# Altium schematic sheet Peripheral.SchDoc
size A4; SheetNumber: 4; SheetTotal: 5; FILE: PERIPHERAL
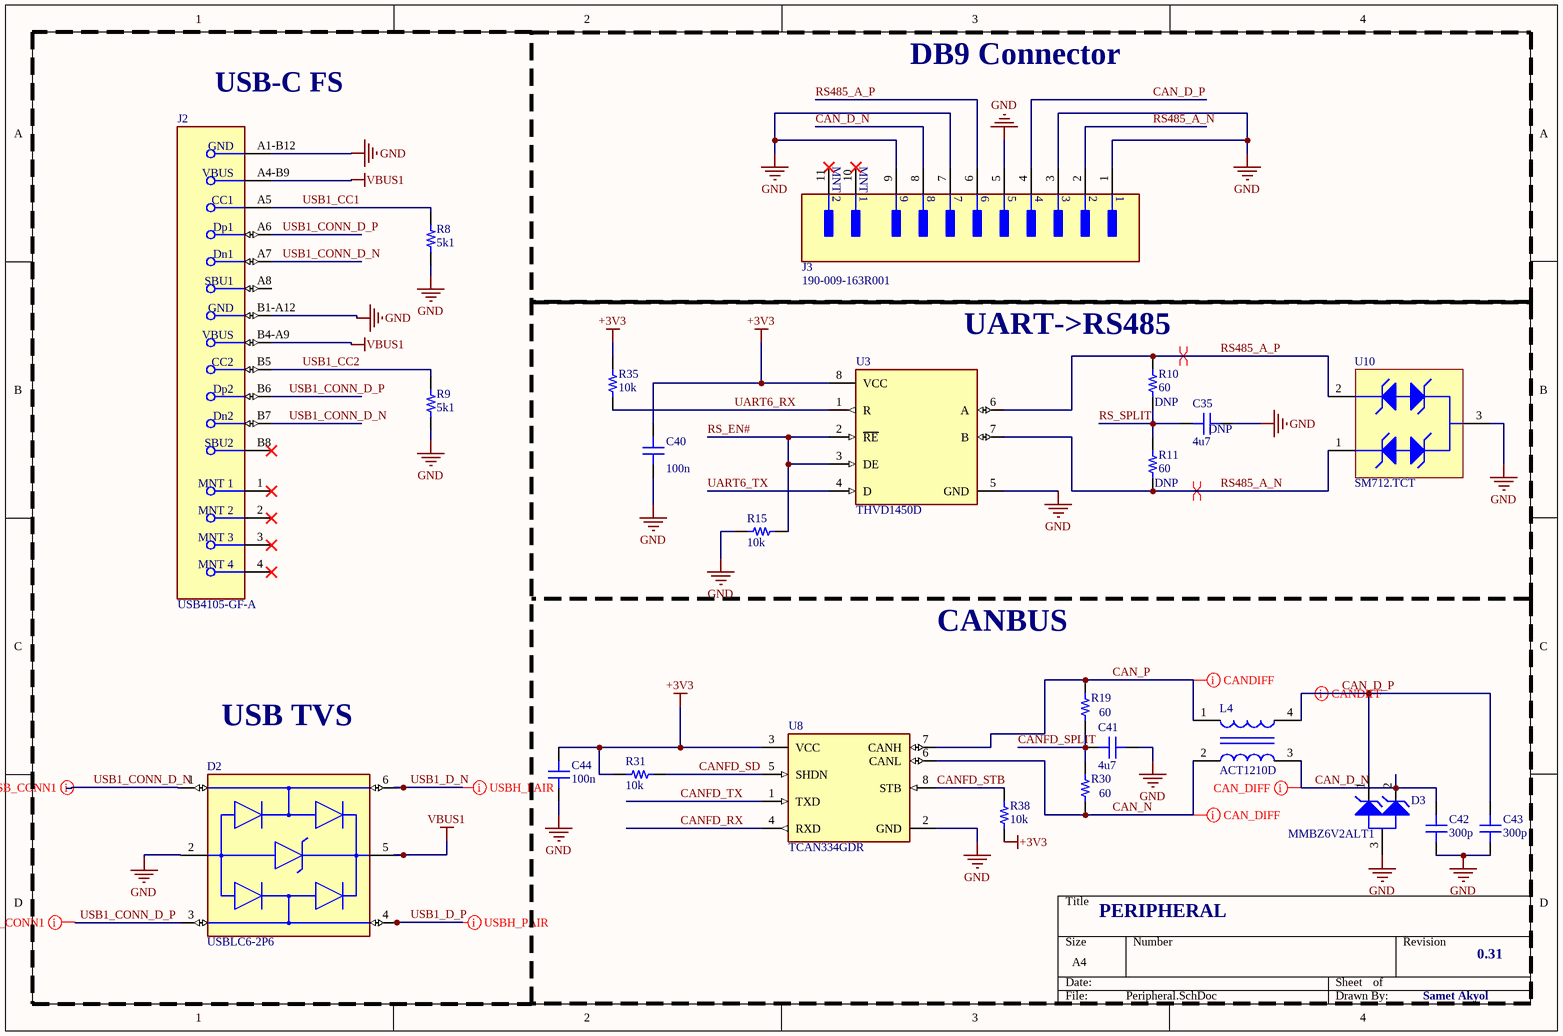
[diagram p0: Peripheral.SchDoc]

## Parts
C35  DNP  value 4u7  [CAP 0402_1005]
C40  value 100n  [CAP 0402_1005]  (hidden comment: DNP)
C41  4u7  [CAP 0402_1005]
C42  300p  [CAP 0402_1005]
C43  300p  [CAP 0402_1005]
C44  100n  [CAP 0402_1005]
D2  USBLC6-2P6  [FP-SOT-666-MFG]
D3  MMBZ6V2ALT1  [ONSC-SOT-23-3-318-08_V]
J2  USB4105-GF-A  [FP-USB4105-GF-A-MFG]
J3  190-009-163R001  [FP-190-009-163R001-MFG]
L4  ACT1210D  [FP-ACT1210D-MFG]
R8  5k1  [RES 0402_1005]
R9  5k1  [RES 0402_1005]
R10  DNP  value 60  [RES 0402_1005]
R11  DNP  value 60  [RES 0402_1005]
R15  10k  [RES 0402_1005]
R19  60  [RES 0402_1005]
R30  60  [RES 0402_1005]
R31  10k  [RES 0402_1005]
R35  value 10k  [RES 0402_1005]
R38  10k  [RES 0402_1005]
U3  THVD1450D  [FP-D0008A-IPC_B]
U8  TCAN334GDR  [FP-D0008A-IPC_B]
U10  SM712.TCT  [SMTC-SOT23-3_V]

## Blocks framed on the sheet
USB TVS: D2 J2 R8 R9

## Nets
+3V3: C40.1 C44.1 R31.2 R35.2 R38.2 U3.8(VCC) U8.3(VCC)
GND: C35.2 C40.2 C41.1 C42.1 C43.1 C44.2 D2.2(GND) D3.3(A) J2.A1-B12(GND) J2.B1-A12(GND) J3.1 J3.3 J3.5 J3.7 J3.9 R8.1 R9.1 R15.2 U3.5(GND) U8.2(GND) U10.3
VBUS1: D2.5(VBUS) J2.A4-B9(VBUS) J2.B4-A9(VBUS)
CAN_D_N: C42.2 D3.2(K2) J3.8 L4.3
CAN_D_P: C43.2 D3.1(K1) J3.4 L4.4
CAN_N: L4.2 R30.1 U8.6(CANL)
CAN_P: L4.1 R19.2 U8.7(CANH)
CANFD_RX: U8.4(RXD)
CANFD_SD: R31.1 U8.5(SHDN)
CANFD_SPLIT: C41.2 R19.1 R30.2
CANFD_STB: R38.1 U8.8(STB)
CANFD_TX: U8.1(TXD)
RS485_A_N: J3.2 R11.1 U3.7(B) U10.1
RS485_A_P: J3.6 R10.2 U3.6(A) U10.2
RS_EN#: R15.1 U3.2(~{RE}) U3.3(DE)
RS_SPLIT: C35.1 R10.1 R11.2
UART6_RX: R35.1 U3.1(R)
UART6_TX: U3.4(D)
USB1_CC1: J2.A5(CC1) R8.2
USB1_CC2: J2.B5(CC2) R9.2
USB1_CONN_D_N: D2.1(I/O1) J2.A7(Dn1) J2.B7(Dn2)
USB1_CONN_D_P: D2.3(I/O2) J2.A6(Dp1) J2.B6(Dp2)
USB1_D_N: D2.6(I/O1)
USB1_D_P: D2.4(I/O2)

Not connected (* = marked no-connect by the designer): J2 1(MNT_1)* 2(MNT_2)* 3(MNT_3)* 4(MNT_4)* A8(SBU1) B8(SBU2)*; J3 10(MNT_1)* 11(MNT_2)*

## Layout directives
differential pair: CAN_D_N, CAN_D_P, CAN_N, CAN_P, RS485_A_N, RS485_A_P, USB1_CONN_D_N, USB1_CONN_D_P, USB1_D_N, USB1_D_P

## Notes on the sheet
- USB-C FS
- DB9 Connector
- UART->RS485
- CANBUS
- PERIPHERAL
- 0.31
- Samet Akyol

## Library data of the parts
C35 = C1005X6S0G475M050BC: CAP CER 4.7UF 4V X6S 0402; manufacturer: TDK Corporation; Capacitance: 4.7 µF; Tolerance: ±20%; Part Number: C1005X6S0G475M050BC; Applications: General Purpose; componentlink1description: Datasheet; componentlink1url: https://product.tdk.com/info/en/catalog/datasheets/mlcc_commercial_general_en.pdf?ref_disty=digikey; componentlink2description: DigiKey Link; componentlink2url: https://www.digikey.com/en/products/detail/tdk-corporation/C1005X6S0G475M050BC/2792242; Device Package: 0402 (1005 Metric); Features: Low ESL; lastupdated: 9.02.2024 20:04:38; Lifecycle Status: Active; Minimum Order: 1; Mounting Type: Surface Mount, MLCC; Operating Temperature: -55°C ~ 105°C; Package / Case: 0402 (1005 Metric); packaging: TapeAndReel; partid: 1756; Part Status: Active; price: 0.06; series: C; Size / Dimension: 0.039" L x 0.020" W (1.00mm x 0.50mm); Supplier 1: DigiKey; Supplier Part Number 1: 445-8017-1-ND; Temperature Coefficient: X6S; Thickness (Max): 0.026" (0.65mm); Voltage - Rated: 4V
C40 = C1005X6S0G475M050BC: CAP CER 0.1UF 4V X6S 0402; manufacturer: TDK Corporation; Capacitance: 4.7 µF; Tolerance: ±20%; Part Number: C1005X6S0G475M050BC; Applications: General Purpose; componentlink1description: Datasheet; componentlink1url: https://product.tdk.com/info/en/catalog/datasheets/mlcc_commercial_general_en.pdf?ref_disty=digikey; componentlink2description: DigiKey Link; componentlink2url: https://www.digikey.com/en/products/detail/tdk-corporation/C1005X6S0G475M050BC/2792242; Device Package: 0402 (1005 Metric); Features: Low ESL; lastupdated: 9.02.2024 20:04:38; Lifecycle Status: Active; Minimum Order: 1; Mounting Type: Surface Mount, MLCC; Operating Temperature: -55°C ~ 105°C; Package / Case: 0402 (1005 Metric); packaging: TapeAndReel; partid: 1756; Part Status: Active; price: 0.06; series: C; Size / Dimension: 0.039" L x 0.020" W (1.00mm x 0.50mm); Supplier 1: DigiKey; Supplier Part Number 1: 445-8017-1-ND; Temperature Coefficient: X6S; Thickness (Max): 0.026" (0.65mm); Voltage - Rated: 4V
C41-C44 = CL05B104KP5VPNC: CAP CER 100NF 10V X7R 0402; manufacturer: Samsung Electro-Mechanics; Capacitance: 0.1 µF; Tolerance: ±10%; Part Number: CL05B104KP5VPNC; Applications: Automotive; componentlink1description: Datasheet; componentlink1url: https://mm.digikey.com/Volume0/opasdata/d220001/medias/docus/5458/CL05B104KP5VPNC_Spec.pdf; componentlink2description: DigiKey Link; componentlink2url: https://www.digikey.com/en/products/detail/samsung-electro-mechanics/CL05B104KP5VPNC/20498482; Device Package: 0402 (1005 Metric); lastupdated: 9.02.2024 20:03:17; Lifecycle Status: Active; Minimum Order: 1; Mounting Type: Surface Mount, MLCC; Operating Temperature: -55°C ~ 125°C; Package / Case: 0402 (1005 Metric); packaging: TapeAndReel; partid: 56690; price: 0.01; Ratings: AEC-Q200; series: CL; Size / Dimension: 0.039" L x 0.020" W (1.00mm x 0.50mm); Supplier 1: DigiKey; Supplier Part Number 1: 1276-CL05B104KP5VPNCCT-ND; Temperature Coefficient: X7R; Thickness (Max): 0.022" (0.55mm); Voltage - Rated: 10V
  C41: Value: 4u7
  C42 C43: Value: 300p
  C44: Value: 100n
D2 = CMP-12225-000058-1: TVS DIODE 5.25V 17V SOT666; Min Breakdown Voltage: 6V; Power Line Protection: Yes; Element Configuration: Dual; Test Current: 1mA; Working Voltage: 5V; Number of Channels: 2; Max Reverse Leakage Current: 150nA; Direction: Unidirectional; Peak Pulse Current: 5A; Number of Elements: 1; Capacitance: 3.5pF; Max Breakdown Voltage: 6V; Height: 0.6mm; Depth: 1.3mm; Contact Plating: Tin; Reverse Breakdown Voltage: 6V; REACH SVHC: No SVHC; Operating Supply Voltage: 5V; Width: 1.3mm; Max Operating Temperature: 125°C; Reverse Standoff Voltage: 5V; ESD Protection: Yes; Package Quantity: 1; Termination: SMD/SMT; Length: 1.7mm; Leakage Current: 150nA; Number of Bidirectional Channels: 2; Case/Package: SOT-666; Min Operating Temperature: -40°C; Number of Pins: 6; Clamping Voltage: 17V; Breakdown Voltage: 6V; Lead Free: Lead Free; Radiation Hardening: No; Packaging: Tape and Reel; Mount: Surface Mount; Polarity: Unidirectional
D3 = CMP-1060-01252-1: 24 W Peak Power Zener Transient Voltage Suppressor, Dual Common Anode Zeners for ESD Protection, 3-Pin SOT-23, Tape and Reel; Manufacturer: On Semiconductor; VZ Typ (V): 6.2; PackageVersion: Rev. AP, 11/2009; PackageReference: SOT-23-3-318-08; Mounting Technology: Surface Mount; ComponentLink3URL: http://www.onsemi.cn/pub_link/Collateral/318-08.PDF; ComponentLink1URL: http://www.onsemi.com/; ComponentLink2URL: http://www.onsemi.cn/pub_link/Collateral/MMBZ5V6ALT1-D.PDF; PartNumber: MMBZ6V2ALT1; Packing: Tape and Reel; ComponentLink1Description: Manufacturer URL; DatasheetVersion: Rev. 13; ComponentLink2Description: Datasheet; PackageDescription: 3-Pin Small Outline Transistor, Body 2.92 x 1.3 mm, Pitch 0.95 mm; ComponentLink3Description: Package Specification
J2 = CMP-245163-000001-1: CONN RCPT USB2.0 TYPEC 5A; Manufacturer: GCT; Voltage Rating: 20V; Is Female: yes; Current Rating: 5/6.25/1.25/0.25A; Number Of Contacts: 16; Conn Orientation: Right Angle; Device Class L1: Connectors; Category: Conn; Lead Free: Yes; RoHS: TRUE; Temperature Range High: +85°C; Digikey Description: CONN RCPT USB2.0 TYPEC 5A; Device Class L3: unset; ComponentLink2Description: Datasheet; Manufacturer Part Number: USB4105-GF-A; Package: 0; Usb Standard: USB 2.0; Device Class L2: USB Connectors; Automotive: No; Temperature Range Low: -40°C; Height: 3.46mm; Temperature: -40°C to +85°C; Contact Material: Gold,Nickel; ComponentLink2URL: https://gct.co/files/drawings/usb4105.pdf; Octopart: https://octopart.com/usb4105-gf-a-gct-106627878
J3 = CMP-00542-00234286-1: 190-009-163R001 D Type Connector, 9 Contact(s), Male, 0.109 inch Pitch, Solder Terminal, #4-40; NexarPartId: 234286; Number of Positions: 9; Connector Type: D-Sub, Plug, Signal; Body Material: Steel; Voltage Rating: 300V; Current Rating: 5A; RoHS: Compliant; Mount: Edge, Surface Mount; Height: 11.38mm; Contact Material: Bronze, Gold; Housing Material: Nylon; REACH SVHC: No SVHC; Color: Black; Lead Free: Lead Free; Termination: SMD/SMT; Min Operating Temperature: -55°C; Max Operating Temperature: 105°C; Features: Shielded; Width: 3.91mm; Gender: Male; Number of Contacts: 9; Housing Color: Black; Length: 30mm; Contact Plating: Gold; Flammability Rating: UL94 V-0; Number of Rows: 2
L4 = CMP-08256-000008-1: CMC 100UH 150MA 2LN SMD AEC-Q200
R8 R9 = CPF0402B1K0E: RES SMD 1K OHM 0.1% 1/16W 0402; Manufacturer: TE Connectivity Passive Product; Power (Watts): 0.063W, 1/16W; Resistance: 1 kOhms; Temperature Coefficient: ±25ppm/°C; Part Number: CPF0402B1K0E; Value: 5k1; ComponentLink1Description: Datasheet; ComponentLink1URL: https://www.te.com/commerce/DocumentDelivery/DDEController?Action=srchrtrv&DocNm=1773200&DocType=DS&DocLang=English; ComponentLink2Description: DigiKey Link; ComponentLink2URL: https://www.digikey.com/en/products/detail/te-connectivity-passive-product/CPF0402B1K0E/4966468; Composition: Thin Film; Device Package: 0402 (1005 Metric); Height - Seated (Max): 0.014" (0.35mm); LastUpdated: 9.02.2024 20:30:24; Lifecycle Status: Active; Minimum Order: 1; Number of Terminations: 2; Operating Temperature: -55°C ~ 155°C; Package / Case: 0402 (1005 Metric); Packaging: TapeAndReel; PartId: 2470; Part Status: Active; Price: 0.10; Series: CPF, Neohm; Size / Dimension: 0.039" L x 0.020" W (1.00mm x 0.50mm); Supplier 1: DigiKey; Supplier Part Number 1: A119928CT-ND; Supplier Device Package: 0402; Tolerance: ±0.1%
R10 R11 R35 = RP73PF1E10KBTD: RES 60 OHM 0.1% 1/10W 0402; Manufacturer: TE Connectivity Passive Product; Power (Watts): 0.1W, 1/10W; Resistance: 10 kOhms; Temperature Coefficient: ±25ppm/°C; Part Number: RP73PF1E10KBTD; ComponentLink1Description: Datasheet; ComponentLink1URL: https://www.te.com/commerce/DocumentDelivery/DDEController?Action=srchrtrv&DocNm=1773272&DocType=DS&DocLang=English; ComponentLink2Description: DigiKey Link; ComponentLink2URL: https://www.digikey.com/en/products/detail/te-connectivity-passive-product/RP73PF1E10KBTD/8260957; Composition: Thin Film; Device Package: 0402 (1005 Metric); Height - Seated (Max): 0.014" (0.35mm); LastUpdated: 9.02.2024 20:30:24; Lifecycle Status: Active; Minimum Order: 1; Number of Terminations: 2; Operating Temperature: -55°C ~ 155°C; Package / Case: 0402 (1005 Metric); Packaging: TapeAndReel; PartId: 2434; Part Status: Active; Price: 0.08; Series: RP73, Holsworthy; Size / Dimension: 0.039" L x 0.020" W (1.00mm x 0.50mm); Supplier 1: DigiKey; Supplier Part Number 1: A127415CT-ND; Supplier Device Package: 0402; Tolerance: ±0.1%
R15 R19 R30 R31 R38 = RP73PF1E10KBTD: RES 10K OHM 0.1% 1/10W 0402; Manufacturer: TE Connectivity Passive Product; Power (Watts): 0.1W, 1/10W; Resistance: 10 kOhms; Temperature Coefficient: ±25ppm/°C; Part Number: RP73PF1E10KBTD; ComponentLink1Description: Datasheet; ComponentLink1URL: https://www.te.com/commerce/DocumentDelivery/DDEController?Action=srchrtrv&DocNm=1773272&DocType=DS&DocLang=English; ComponentLink2Description: DigiKey Link; ComponentLink2URL: https://www.digikey.com/en/products/detail/te-connectivity-passive-product/RP73PF1E10KBTD/8260957; Composition: Thin Film; Device Package: 0402 (1005 Metric); Height - Seated (Max): 0.014" (0.35mm); LastUpdated: 9.02.2024 20:30:24; Lifecycle Status: Active; Minimum Order: 1; Number of Terminations: 2; Operating Temperature: -55°C ~ 155°C; Package / Case: 0402 (1005 Metric); Packaging: TapeAndReel; PartId: 2434; Part Status: Active; Price: 0.08; Series: RP73, Holsworthy; Size / Dimension: 0.039" L x 0.020" W (1.00mm x 0.50mm); Supplier 1: DigiKey; Supplier Part Number 1: A127415CT-ND; Supplier Device Package: 0402; Tolerance: ±0.1%
  R15 R31 R38: Value: 10k
  R19 R30: Value: 60
U3 = CMP-04875-000070-1: IC TRANSCEIVER HALF 1/1 8SOIC; Simplex/Duplex: Half Duplex; Receiver Hysteresis: 30mV; Data Rate: 50Mbps; RoHS Compliant: Yes; Packaging: Rail/Tube; Case/Package: SOIC; Mount: Surface Mount; Max Operating Temperature: 125°C; Min Operating Temperature: -40°C
U8 = CMP-04872-000213-1: IC TRANSCEIVER 1/1 8SOIC; Receiver Hysteresis: 120mV; Data Rate: 1Mbps; Mount: Surface Mount; Lead Free: Lead Free; Max Operating Temperature: 125°C; Case/Package: SOIC; RoHS Compliant: Yes; Packaging: Tape and Reel; Min Operating Temperature: -40°C
U10 = CMP-2000-05357-1: Asymmetrical TVS Diode for Extended Common-Mode RS-485, 400 W, -55 to 125 degC, 3-Pin SOT23, RoHS, Tape and Reel; Manufacturer: Semtech; Configuration: Dual; Peak Pulse Power Dissipation: 400W; Product Length (mm): 2.9mm; Working Voltage: 12V/7V; Product Height (mm): 0.95mm; Direction Type: Bi-Directional; Product Depth (mm): 1.3mm; Reverse Breakdown Voltage: 13.3V; Reverse Stand-off Voltage: 12V; Leakage Current (Max): 0.02uA; Number of Elements: 2; Peak Pulse Current: 17A; Leakage Current: 1uA/20uA; Rad Hardened: No; Test Current (It): 1mA; Clamping Voltage: 26V/12V; Datasheet URL: https://datasheet.ciiva.com/18065/getdatasheetpartid-110620-18065348.pdf; Operating Temperature Classification: Military; Operating Temperature Min Deg. C: -55C; Manufacturer URL: http://www.semtech.com/; Package Reference: SOT23-3; Operating Temp Range: -55Cto125C; Mounting Style: SurfaceMount; Polarity: Bi-Directional; Pin Count: 3; Package Description: 3-Pin Small Outline Transistor, Body 2.9 x 1.3 mm, Pitch 0.95 mm; Datasheet Version: Nov-04; Mounting: SurfaceMount; Suppressor Type: TVS; Packaging: TapeandReel; Package / Case: SOT-23; Operating Temperature Max Deg. C: 125C